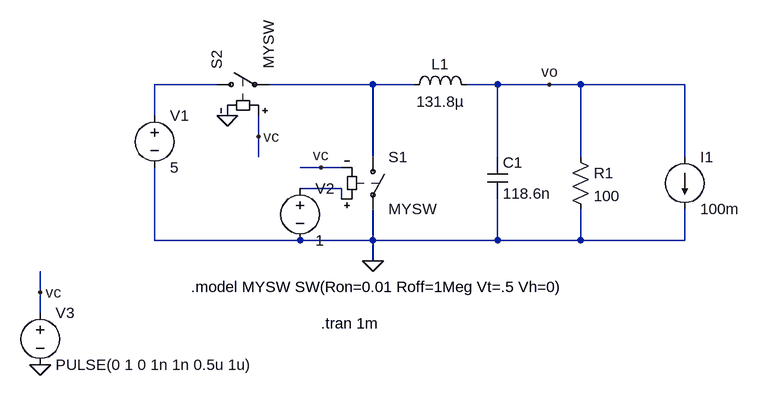
[diagram p0: schematic Q1.asc]
Q1.asc, the LTspice schematic file:
Version 4
SHEET 1 896 680
WIRE 80 -16 -16 -16
WIRE 320 -16 160 -16
WIRE 384 -16 320 -16
WIRE 512 -16 464 -16
WIRE 592 -16 512 -16
WIRE 640 -16 592 -16
WIRE 800 -16 640 -16
WIRE -16 32 -16 -16
WIRE 144 64 144 32
WIRE 144 96 144 64
WIRE 320 96 320 -16
WIRE 512 96 512 -16
WIRE 640 96 640 -16
WIRE 800 96 800 -16
WIRE 240 112 208 112
WIRE 272 112 240 112
WIRE 272 144 208 144
WIRE 272 160 272 144
WIRE -16 224 -16 112
WIRE 208 224 -16 224
WIRE 320 224 320 176
WIRE 320 224 208 224
WIRE 512 224 512 160
WIRE 512 224 320 224
WIRE 640 224 640 176
WIRE 640 224 512 224
WIRE 800 224 800 176
WIRE 800 224 640 224
WIRE 320 256 320 224
WIRE -192 304 -192 272
WIRE -192 336 -192 304
FLAG 96 32 0
FLAG 320 256 0
FLAG 144 64 vc
FLAG 240 112 vc
FLAG -192 304 vc
FLAG -192 416 0
FLAG 592 -16 vo
SYMBOL sw 320 80 R0
SYMATTR InstName S1
SYMATTR Value MYSW
SYMBOL sw 64 -16 R270
SYMATTR InstName S2
SYMATTR Value MYSW
SYMBOL voltage -16 16 R0
WINDOW 123 0 0 Left 2
WINDOW 39 0 0 Left 2
SYMATTR InstName V1
SYMATTR Value 5
SYMBOL ind 368 0 R270
WINDOW 0 32 56 VTop 2
WINDOW 3 5 56 VBottom 2
SYMATTR InstName L1
SYMATTR Value 131.8µ
SYMBOL cap 496 96 R0
SYMATTR InstName C1
SYMATTR Value 118.6n
SYMBOL res 624 80 R0
SYMATTR InstName R1
SYMATTR Value 100
SYMBOL voltage 208 128 R0
WINDOW 123 0 0 Left 2
WINDOW 39 0 0 Left 2
SYMATTR InstName V2
SYMATTR Value 1
SYMBOL voltage -192 320 R0
WINDOW 123 0 0 Left 2
WINDOW 39 0 0 Left 2
SYMATTR InstName V3
SYMATTR Value PULSE(0 1 0 1n 1n 0.5u 1u)
SYMBOL current 800 96 R0
WINDOW 123 0 0 Left 2
WINDOW 39 0 0 Left 2
SYMATTR InstName I1
SYMATTR Value 100m
TEXT 40 296 Left 2 !.model MYSW SW(Ron=0.01 Roff=1Meg Vt=.5 Vh=0)
TEXT 240 352 Left 2 !.tran 1m

The netlist it stands for:
* Q1.asc
S1 N002 0 N003 vc MYSW
S2 N001 N002 vc 0 MYSW
V1 N001 0 5
L1 N002 vo 131.8µ
C1 vo 0 118.6n
R1 vo 0 100
V2 N003 0 1
V3 vc 0 PULSE(0 1 0 1n 1n 0.5u 1u)
I1 vo 0 100m
.model MYSW SW(Ron=0.01 Roff=1Meg Vt=.5 Vh=0)
.tran 1m
.backanno
.end